# EAGLE design Netzteil_OPV (EAGLE 6.5.0)
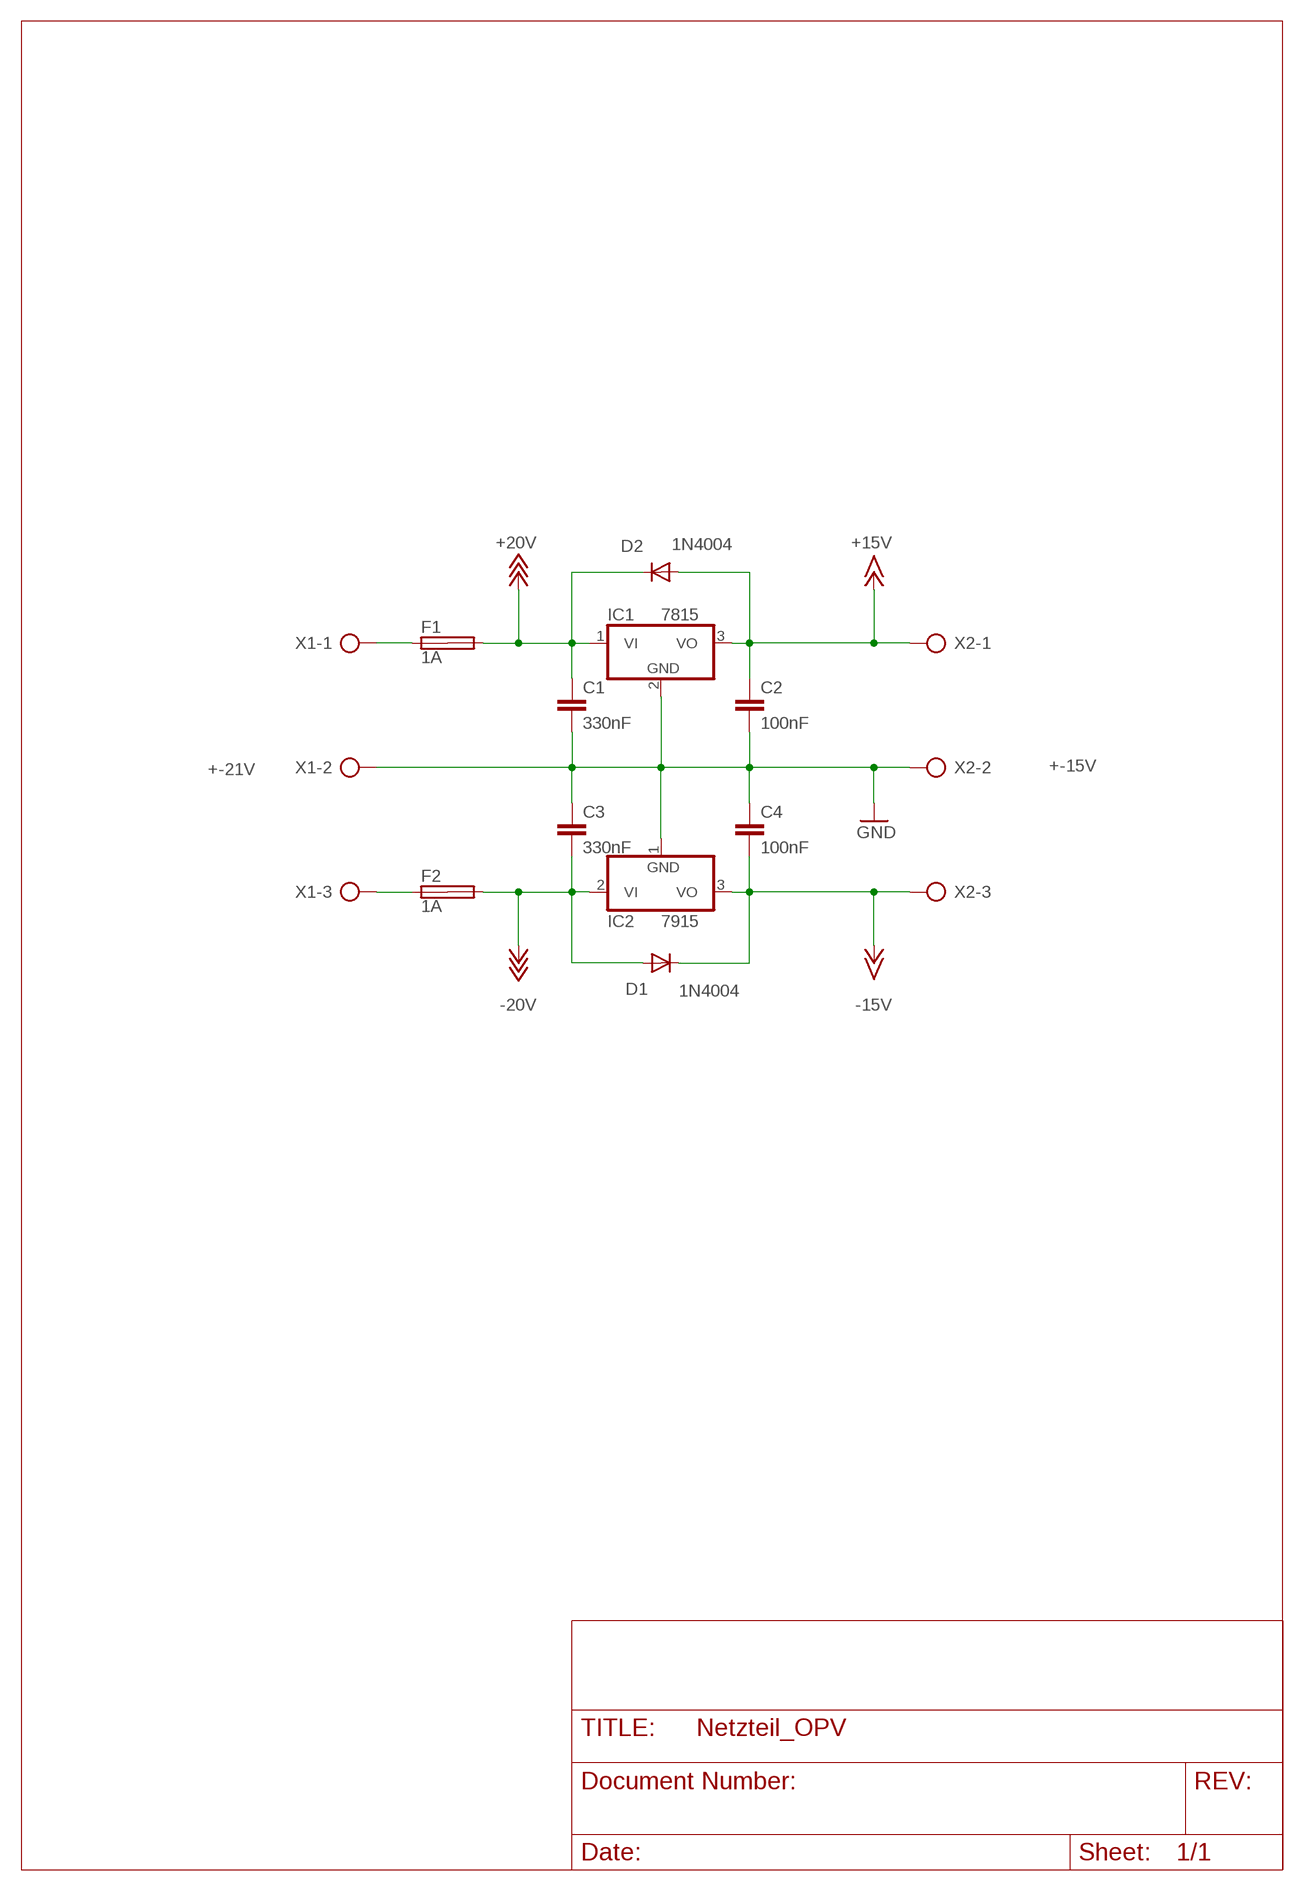
[diagram p0: schematic, sheet 1]

## Parts
C1  330nF  C-EU025-025X050  [C025-025X050]
C2  100nF  C-EU025-025X050  [C025-025X050]
C3  330nF  C-EU025-025X050  [C025-025X050]
C4  100nF  C-EU025-025X050  [C025-025X050]
D1  1N4004  [DO41-10]
D2  1N4004  [DO41-10]
F1  1A  SHK20L  [SHK20L]
F2  1A  SHK20L  [SHK20L]
IC1  7815  7815T  [TO220H]
IC2  7915  7915T  [TO220H]
X1  +-21V  AK300/3  [AK300/3]
X2  +-15V  AK300/3  [AK300/3]

## Nets
+15V: C2.1 D2.A IC1.3(VO) X2.1
+18V: C1.1 D2.C F1.2A IC1.1(VI) ; supply symbol labelled +20V
-15V: C4.2 D1.C IC2.3(VO) X2.3
-18V: C3.2 D1.A F2.2A IC2.2(VI) ; supply symbol labelled -20V
GND: C1.2 C2.2 C3.1 C4.1 IC1.2(GND) IC2.1(GND) X1.2 X2.2
N$1: F1.1A X1.1
N$3: F2.1A X1.3
Unconnected: F1.1B F1.2B F2.1B F2.2B

## Library data of the parts
C1-C4 = rcl:C-EU: CAPACITOR, European symbol
D1 D2 = diode:1N4004: DIODE general purpose rectifier, 1 A
F1 F2 = fuse:SHK20L: FUSE HOLDER 5 x 20 mm, SH contact, SHH1 Schukat, E1073 Buerklin; OC_FARNELL: unknown; OC_NEWARK: unknown
IC1 = linear:78*: Positive VOLTAGE REGULATOR Source: http://cache.national.com/ds/LM/LM78L05.pdf http://www.fairchildsemi.com/ds/LM/LM7805.pdf
IC2 = linear:79*: Negative VOLTAGE REGULATOR
X1 X2 = con-ptr500:AK300/3: CONNECTOR; OC_FARNELL: unknown; OC_NEWARK: unknown

## Board
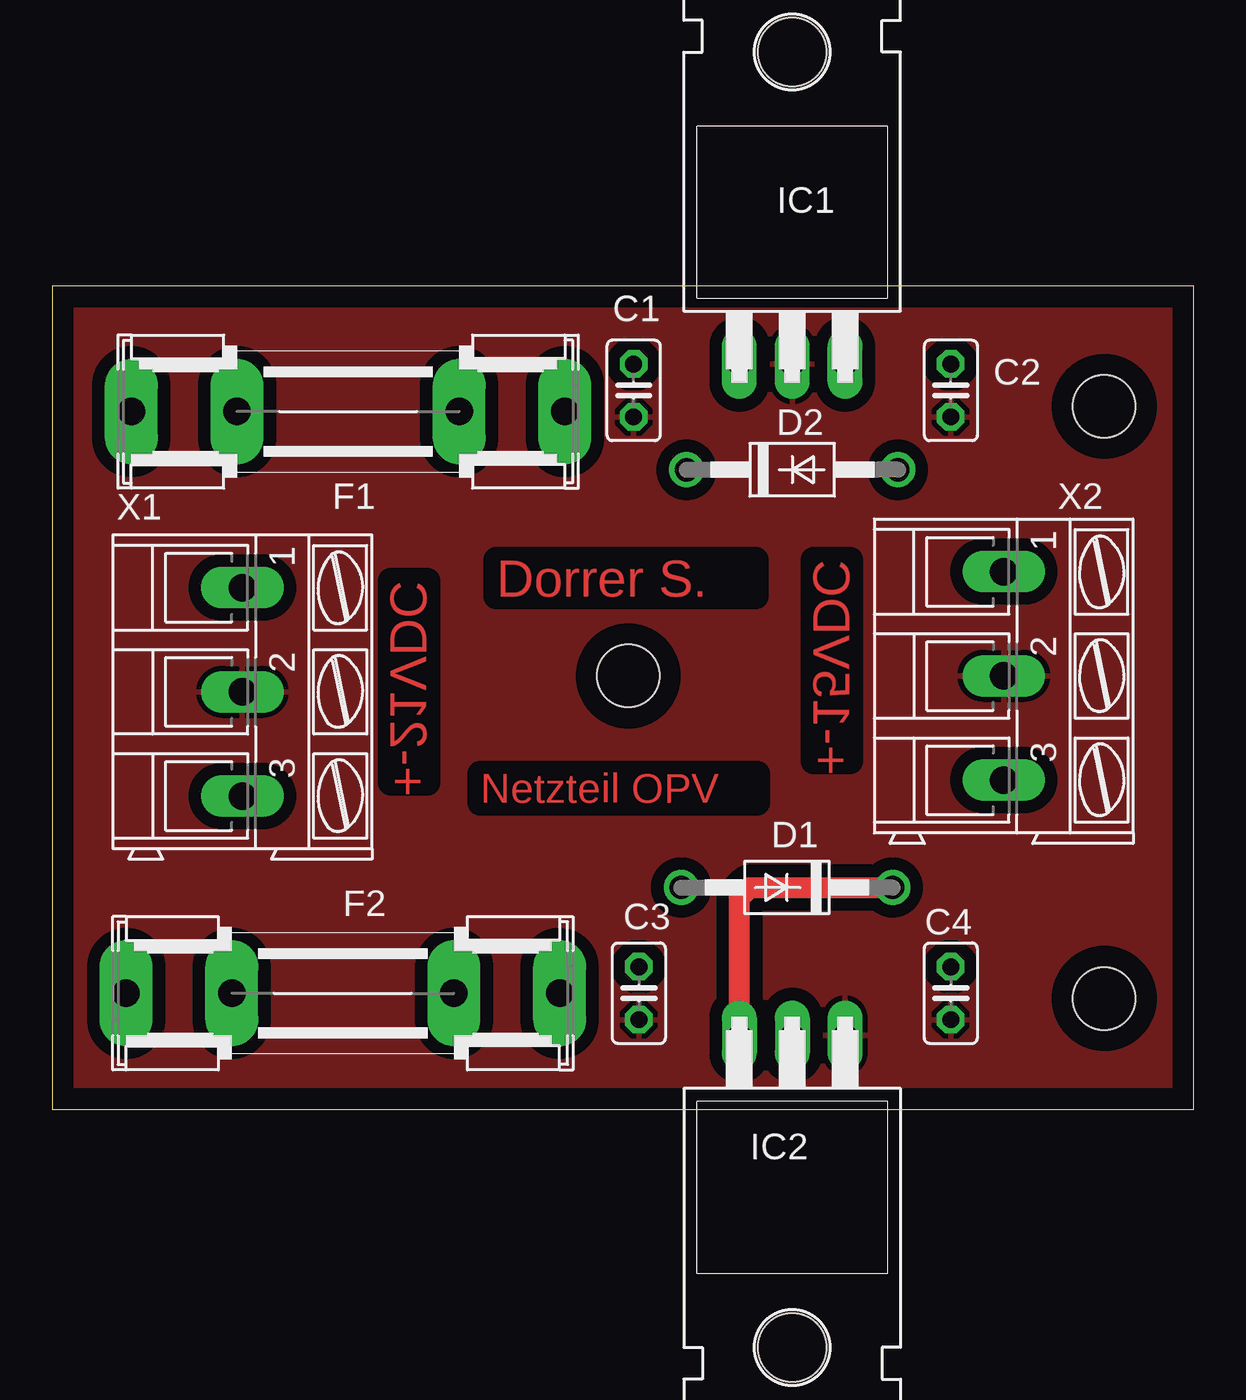
[diagram p1: board, top side]
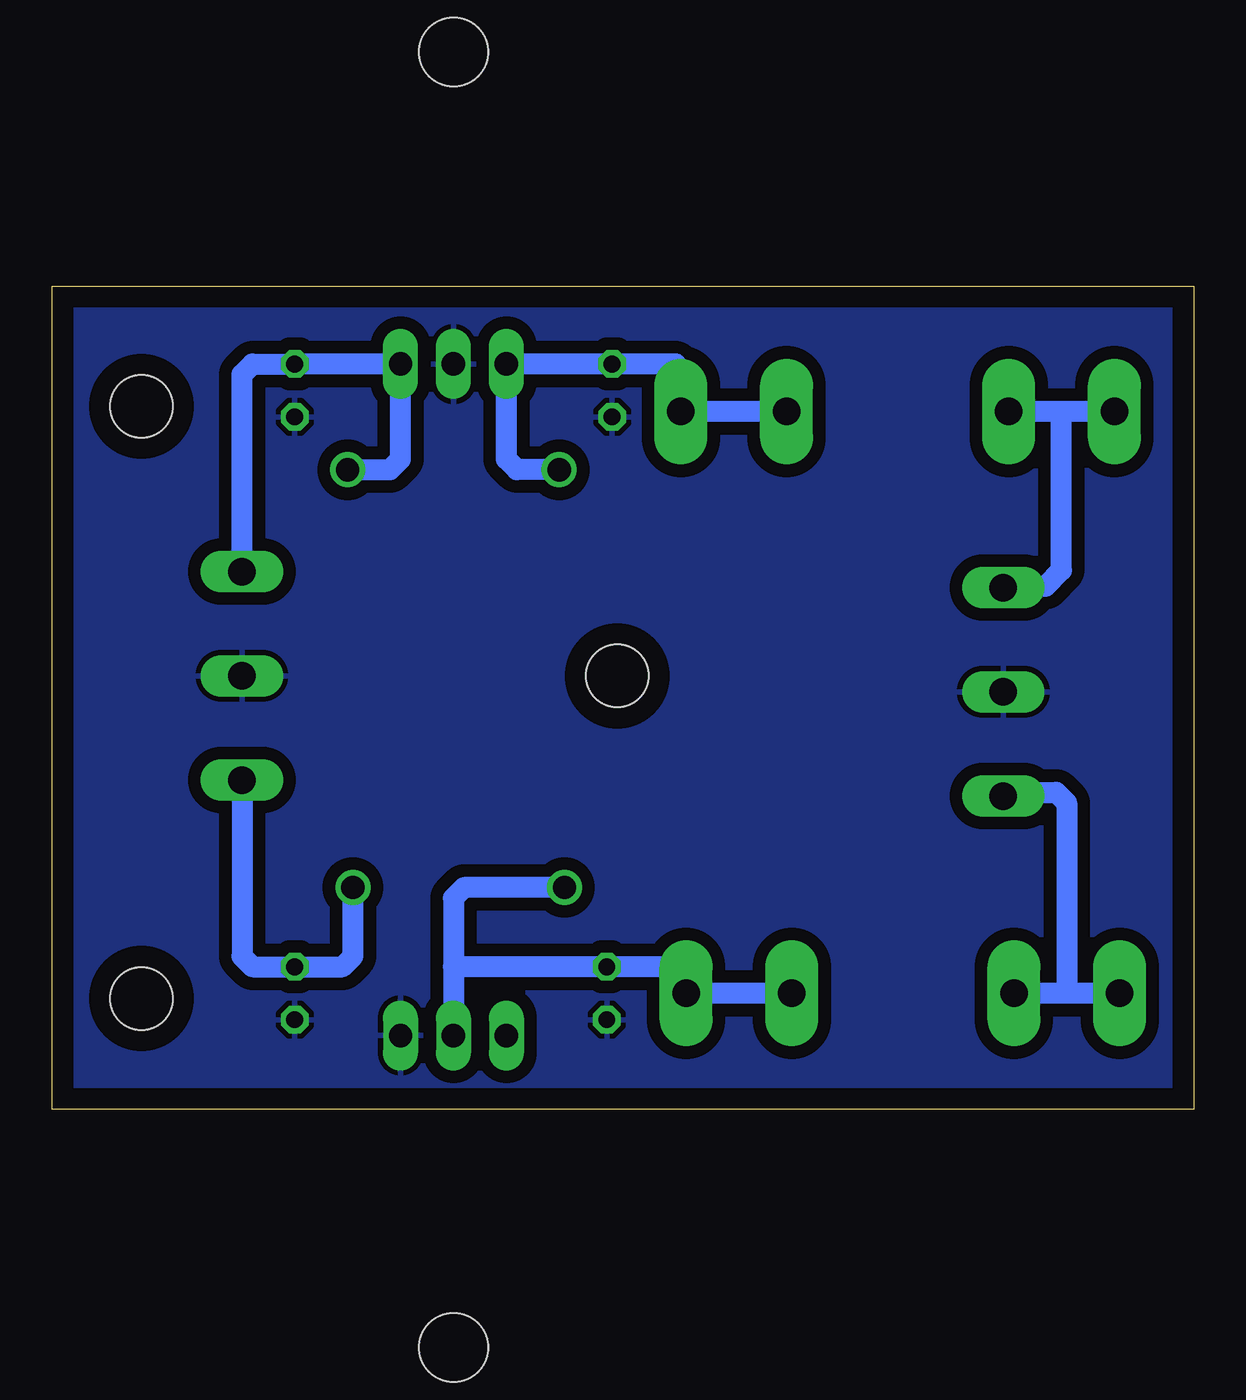
[diagram p2: board, bottom side, seen from below]

Size 54.84 x 39.55 mm. Coordinates in mm from the lower left corner, seen from the top.
Outline: 0,0 54.84,0 54.84,39.55 0,39.55 0,0
Copper layers (1*16): Top 0.035mm / dielectric 1.5mm / Bottom 0.035mm
Design rules "default": minimum track width 10mil, minimum drill 24mil, track to track 8mil, track to pad 8mil, pad to pad 8mil, via to via 8mil, smd to smd 8mil, copper to edge 40mil, drill to drill 8mil, minimum pad ring 10mil, minimum via ring 8mil, stop-mask expansion 4mil, vias tented up to drill 0mil, thermal gap 10mil
Holes 3 mm at 27.69,20.83 50.55,33.78 50.55,5.33

### Footprints (pad centres in the part's own frame; a part is rotated, then mirrored left to right if it is on the bottom)
C025-025X050 = drill 0.813 octagon: 1 -1.27,0; 2 1.27,0
DO41-10 = drill 1.118: A 5.08,0; C -5.08,0
SHK20L = drill 1.321 pad 2.54 long: 1A -10.414,0; 1B -5.334,0; 2A 10.414,0; 2B 5.334,0
TO220H = drill 1.118 long: 1 -2.54,-10.16; 2 0,-10.16; 3 2.54,-10.16 | hole 3.302: 0,4.826
AK300/3 = drill 1.321 long: 1 -5.004,0; 2 0,0; 3 5.004,0

### Placement (x,y rotation side)
C1  27.94,34.54 270 top
C2  43.18,34.54 270 top
C3  28.19,5.59 90 top
C4  43.18,5.59 90 top
D1  35.31,10.67 180 top
D2  35.56,30.73 0 top
F1  14.22,33.53 0 top
F2  13.97,5.59 0 top
IC1  35.56,45.97 0 top
IC2  35.56,-6.6 180 top
X1  9.14,20.07 270 top
X2  45.72,20.83 270 top

### Tracks (layer width: path | path; a pad name or v marks a point on that pad's centre or on a via)
+15V
  Bottom 1.016: D2.A 38.61,30.73 38.1,31.24 IC1.3 C2.1 45.21,35.81 45.72,35.31 X2.1
+18V
  Bottom 1.016: 19.56,33.53 F1.2A 24.38,33.53 24.38,35.31 24.89,35.81 C1.1 IC1.1 33.02,31.24 32.51,30.73 D2.C
-15V
  Top 1.016: IC2.3 33.02,10.16 33.53,10.67 D1.C
  Bottom 1.016: D1.C 40.39,7.37 40.89,6.86 C4.2 45.21,6.86 45.72,7.37 X2.3
-18V
  Bottom 1.016: D1.A 35.05,10.67 35.56,10.16 35.56,6.86 | 35.56,6.86 IC2.2 | 35.56,6.86 C3.2 24.89,6.86 24.38,6.35 F2.2A 19.3,5.59
GND
  pour Bottom (isolate 0.61): 0,0 0,39.62 54.86,39.62 54.86,0
  pour Top (isolate 0.61): 0,0 0,39.62 54.86,39.62 54.86,0
N$1
  Bottom 1.016: F1.1A 6.35,33.53 | 6.35,33.53 8.89,33.53 | X1.1 9.07,25.15 7.11,25.15 6.35,25.91 6.35,33.53
N$3
  Bottom 1.016: F2.1A 6.1,5.59 | 6.1,5.59 8.64,5.59 | X1.3 8.97,15.24 6.6,15.24 6.1,14.73 6.1,5.59

### Text on the board
Top: +-15VDC | +-21VDC | Dorrer S. | Netzteil OPV